# Altium schematic sheet CAN_5V.SchDoc
size A
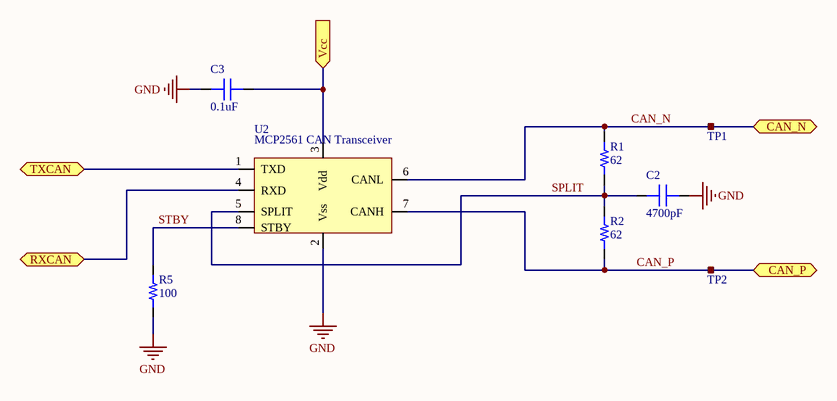
[diagram p0: CAN_5V.SchDoc]

## Parts
C2  capacitance: 4700pF  [0603]  (hidden comment: capacitor)
C3  capacitance: 0.1uF  [0603]  (hidden comment: capacitor)
R1  62  [RES 0603/1608]
R2  resistance: 62  [0603]  (hidden comment: resistor)
R5  resistance: 100  [0603]  (hidden comment: resistor)
TP1  RCU-0C  [RCU-0C]  (value not drawn)
TP2  RCU-0C  [RCU-0C]  (value not drawn)
U2  MCP2561 CAN Transceiver  [SOIC-8]

## Ports
CAN_N (bidir), CAN_P (bidir), RXCAN (bidir), TXCAN (bidir), Vcc (in)

## Nets
GND: C2.2 C3.1 R5.2 U2.2(Vss)
CAN_N: R1.2 TP1.1 U2.6(CANL) ; port CAN_N
CAN_P: R2.2 TP2.1 U2.7(CANH) ; port CAN_P
RXCAN: U2.4(RXD) ; port RXCAN
SPLIT: C2.1 R1.1 R2.1 U2.5(SPLIT)
STBY: R5.1 U2.8(STBY)
TXCAN: U2.1(TXD) ; port TXCAN
Vcc: C3.2 U2.3(Vdd) ; port Vcc

## Library data of the parts
C2 C3 = 1: Generic 0603 capacitor; id: 1; voltage: 50; dielectric: Ceramic; percent tolerance: 10; name: 0603 Capacitor; ESR: 1; package: 0603; quantity: 0
R1 R2 R5 = 1: id: 1; name: 0603 Resistor; percent tolerance: 5; package: 0603; quantity: 0
  R1: resistance: 62
TP1 TP2 = 14: id: 14; numcontacts: 1; name: RCU-0C; numrows: 1; quantity: 0; link: https://www.digikey.com/product-detail/en/te-connectivity-amp-connectors/RCU-0C/A106145CT-ND/3477802
U2 = 5: id: 5; name: null; vcc: 0; type: CAN; package: SOIC-8; quantity: 0; link: https://www.digikey.com/product-detail/en/microchip-technology/MCP2561T-E-SN/MCP2561T-E-SNCT-ND/5148846